# EAGLE design TSS_Rev3_Shield (EAGLE 7.3.0)
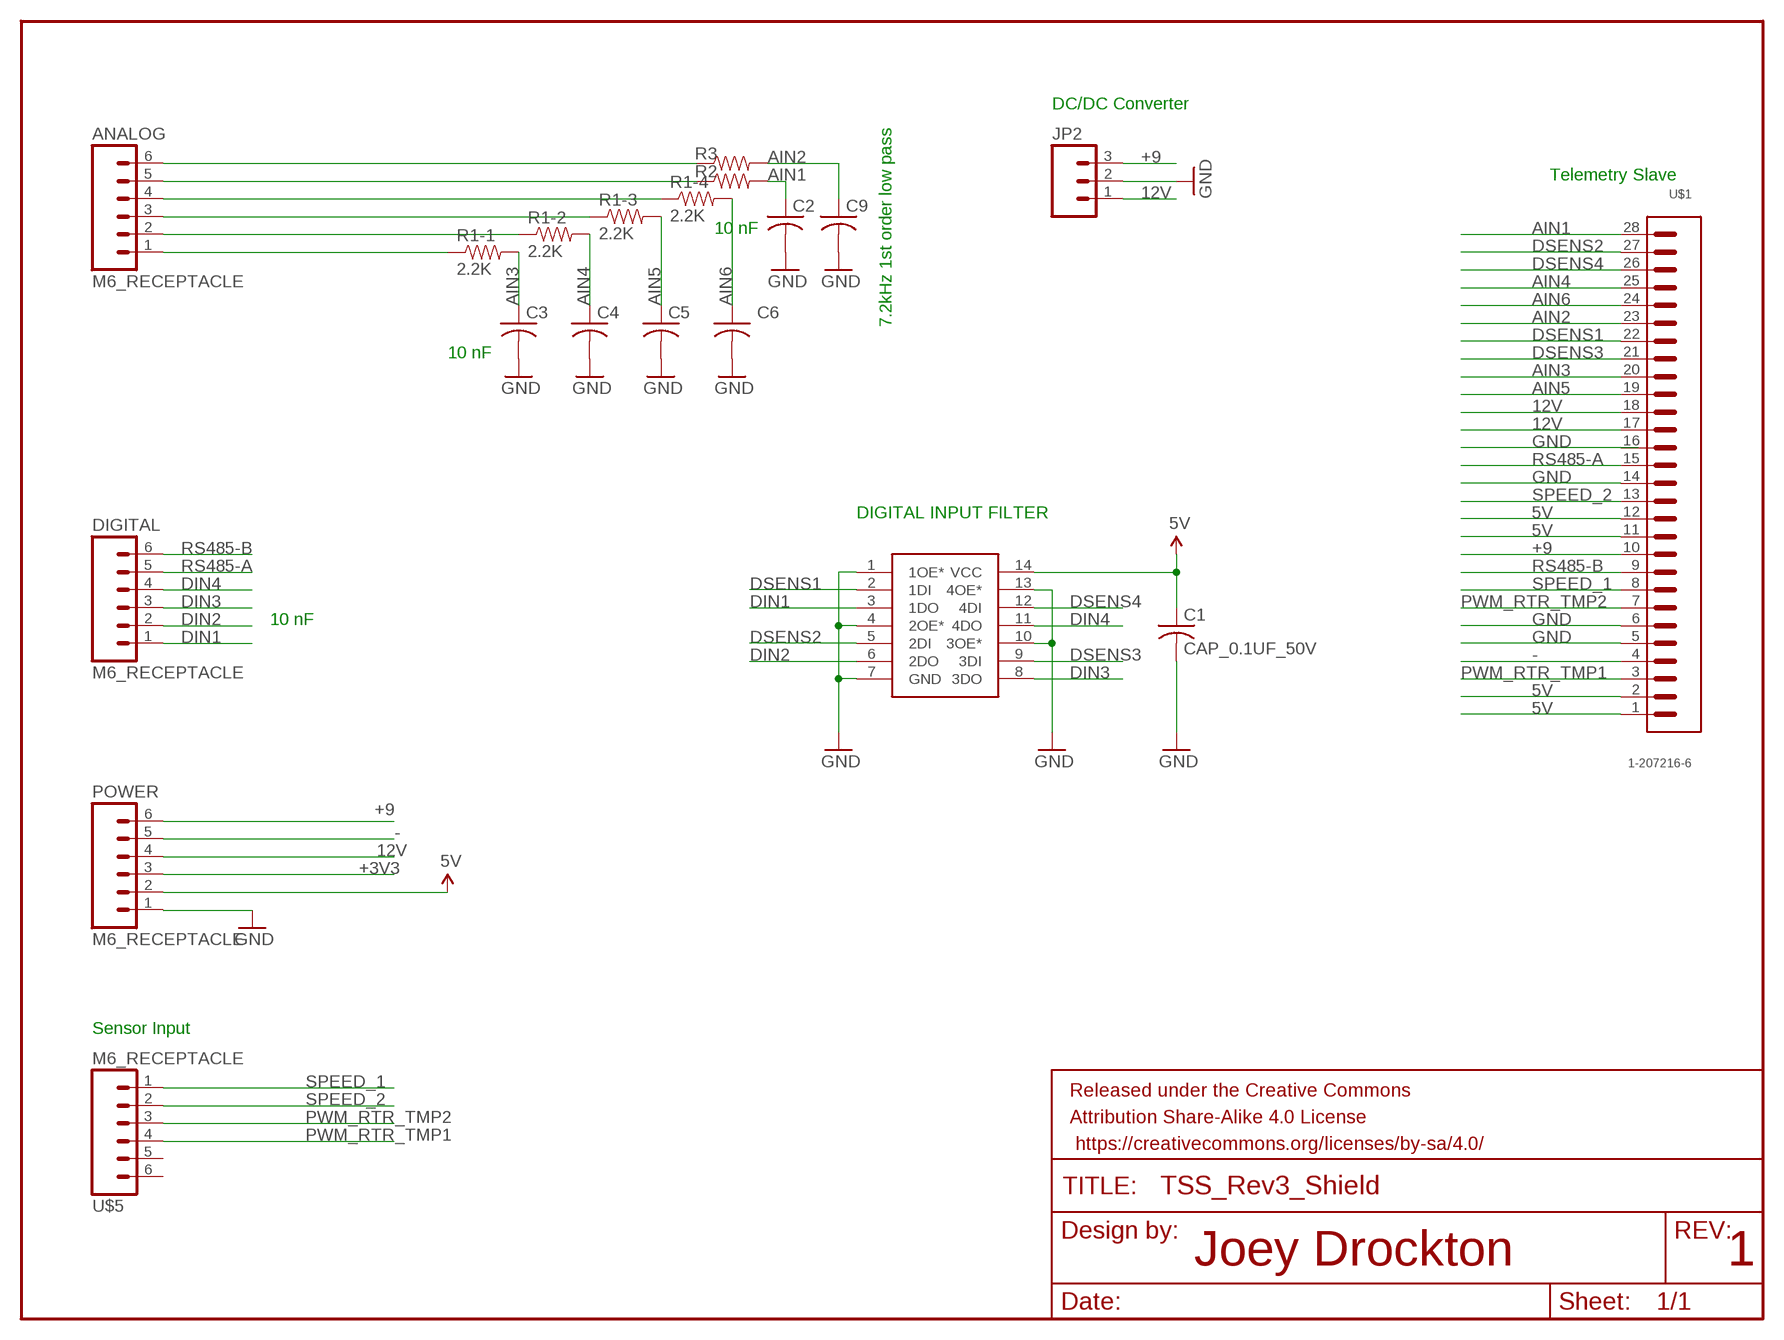
[diagram p0: schematic, sheet 1]

## Parts
ANALOG  M6_RECEPTACLE  [6X.1]
C1  CAP_0.1UF_50V  [0603]
C2  CAP_10NF_50V  [0603]
C3  CAP_10NF_50V  [0603]
C4  CAP_10NF_50V  [0603]
C5  CAP_10NF_50V  [0603]
C6  CAP_10NF_50V  [0603]
C9  CAP_10NF_50V  [0603]
DIGITAL  M6_RECEPTACLE  [6X.1]
FRAME1  FRAME-LETTERNO_PACKAGE  [DUMMY]
JP2  M03PTH  [1X03]
POWER  M6_RECEPTACLE  [6X.1]
R1  2.2K  RN-4_2.2K  [MNR14]
R2  RES_2.2K_1%  [0603]
R3  RES_2.2K_1%  [0603]
U$1  1-207216-6  [1-207216-6]
U$2  74HC125S14-13  [SO-14]
U$5  M6_RECEPTACLE  [6X.1]

## Nets
5V: C1.1(+) POWER.2 U$1.1 U$1.2 U$1.11 U$1.12 U$2.14(VCC)
12V: JP2.1 POWER.4 U$1.17 U$1.18
+3V3: POWER.3
+9: JP2.3 POWER.6 U$1.10
-: POWER.5 U$1.4
AIN1: C2.1(+) R2.2 U$1.28
AIN2: C9.1(+) R3.2 U$1.23
AIN3: C3.1(+) R1.8 U$1.20
AIN4: C4.1(+) R1.7 U$1.25
AIN5: C5.1(+) R1.6 U$1.19
AIN6: C6.1(+) R1.5 U$1.24
DIN1: DIGITAL.1 U$2.3(1DO)
DIN2: DIGITAL.2 U$2.6(2DO)
DIN3: DIGITAL.3 U$2.8(3DO)
DIN4: DIGITAL.4 U$2.11(4DO)
DSENS1: U$1.22 U$2.2(1DI)
DSENS2: U$1.27 U$2.5(2DI)
DSENS3: U$1.21 U$2.9(3DI)
DSENS4: U$1.26 U$2.12(4DI)
GND: C1.2(-) C2.2(-) C3.2(-) C4.2(-) C5.2(-) C6.2(-) C9.2(-) JP2.2 POWER.1 U$1.5 U$1.6 U$1.14 U$1.16 U$2.1(1OE*) U$2.4(2OE*) U$2.7(GND) U$2.10(3OE*) U$2.13(4OE*)
N$1: ANALOG.6 R3.1
N$2: ANALOG.5 R2.1
N$5: ANALOG.4 R1.4
N$6: ANALOG.3 R1.3
N$10: ANALOG.2 R1.2
N$11: ANALOG.1 R1.1
PWM_RTR_TMP1: U$1.3 U$5.4
PWM_RTR_TMP2: U$1.7 U$5.3
RS485-A: DIGITAL.5 U$1.15
RS485-B: DIGITAL.6 U$1.9
SPEED_1: U$1.8 U$5.1
SPEED_2: U$1.13 U$5.2
Unconnected: U$5.5 U$5.6

## Notes on the sheet
- DC/DC Converter
- 7.2kHz 1st order low pass
- Telemetry Slave
- 10 nF
- 10 nF
- DIGITAL INPUT FILTER
- 10 nF
- Sensor Input
- Joey Drockton | 1

## Library data of the parts
ANALOG DIGITAL POWER U$5 = FSAE Electric:M6_RECEPTACLE; PARTNO: A32907-ND
C1 = FSAE Electric:CAP; PARTNO: CC0603ZRY5V9BB104
C2-C6 C9 = FSAE Electric:CAP; PARTNO: CL10F103ZB8NNNC
FRAME1 = SparkFun-Aesthetics:FRAME-LETTER: Schematic Frame Standard 8.5x11 US Letter frame; DESIGNER: Nobody; VERSION: v01
JP2 = SparkFun-Connectors:M03: Header 3 Standard 3-pin 0.1" header. Use with straight break away headers (SKU : PRT-00116), right angle break away headers (PRT-00553), swiss pins (PRT-00743), machine pins (PRT-00117), and female headers (PRT-00115). Molex polarized connector foot print use with SKU : PRT-08232 with associated crimp pins and housings.
R1 = FSAE Electric:RN-4; PARTNO: MNR14ERAPJ222
R2 R3 = FSAE Electric:RES: Resistors; PARTNO: RC0603FR-072K2L
U$1 = FSAE Electric:1-207216-6: TE 28 Pin Recepticle to board connector; PARTNO: 1-207216-6
U$2 = FSAE Electric:74HC125S14-13: QUAD IN SHMITT TRIGGER; PARTNO: 74HC125S14-13DICT-ND

## Board
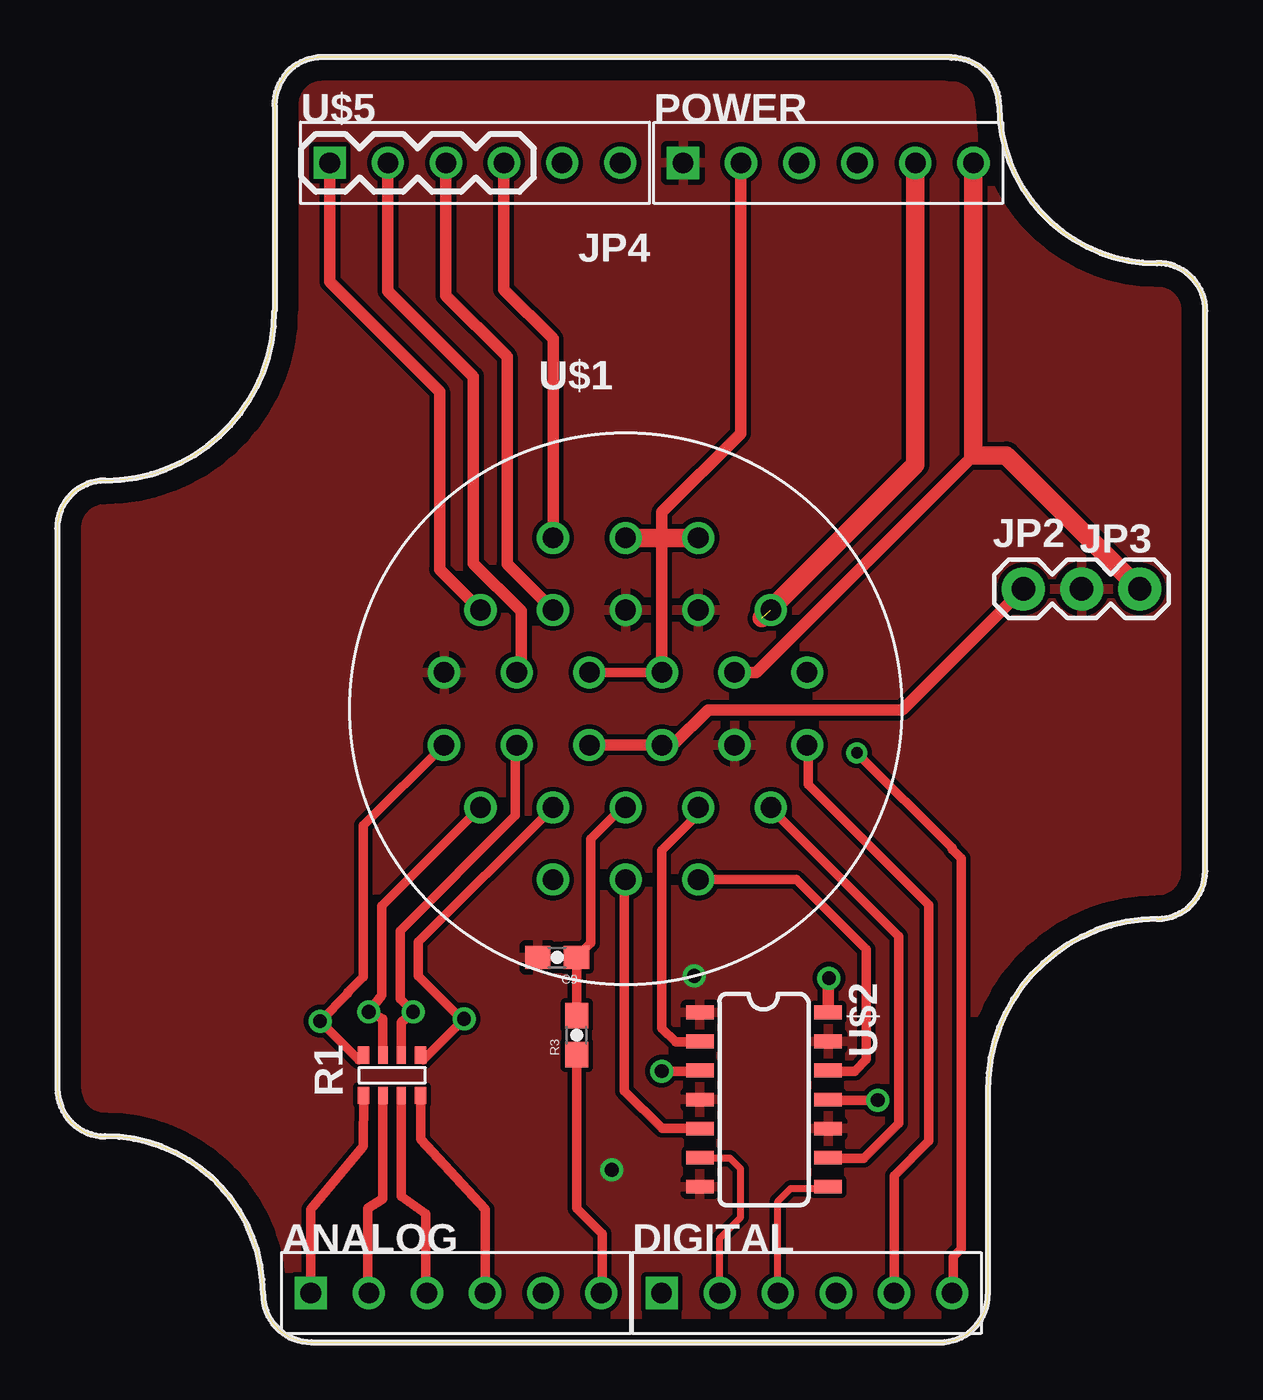
[diagram p1: board, top side]
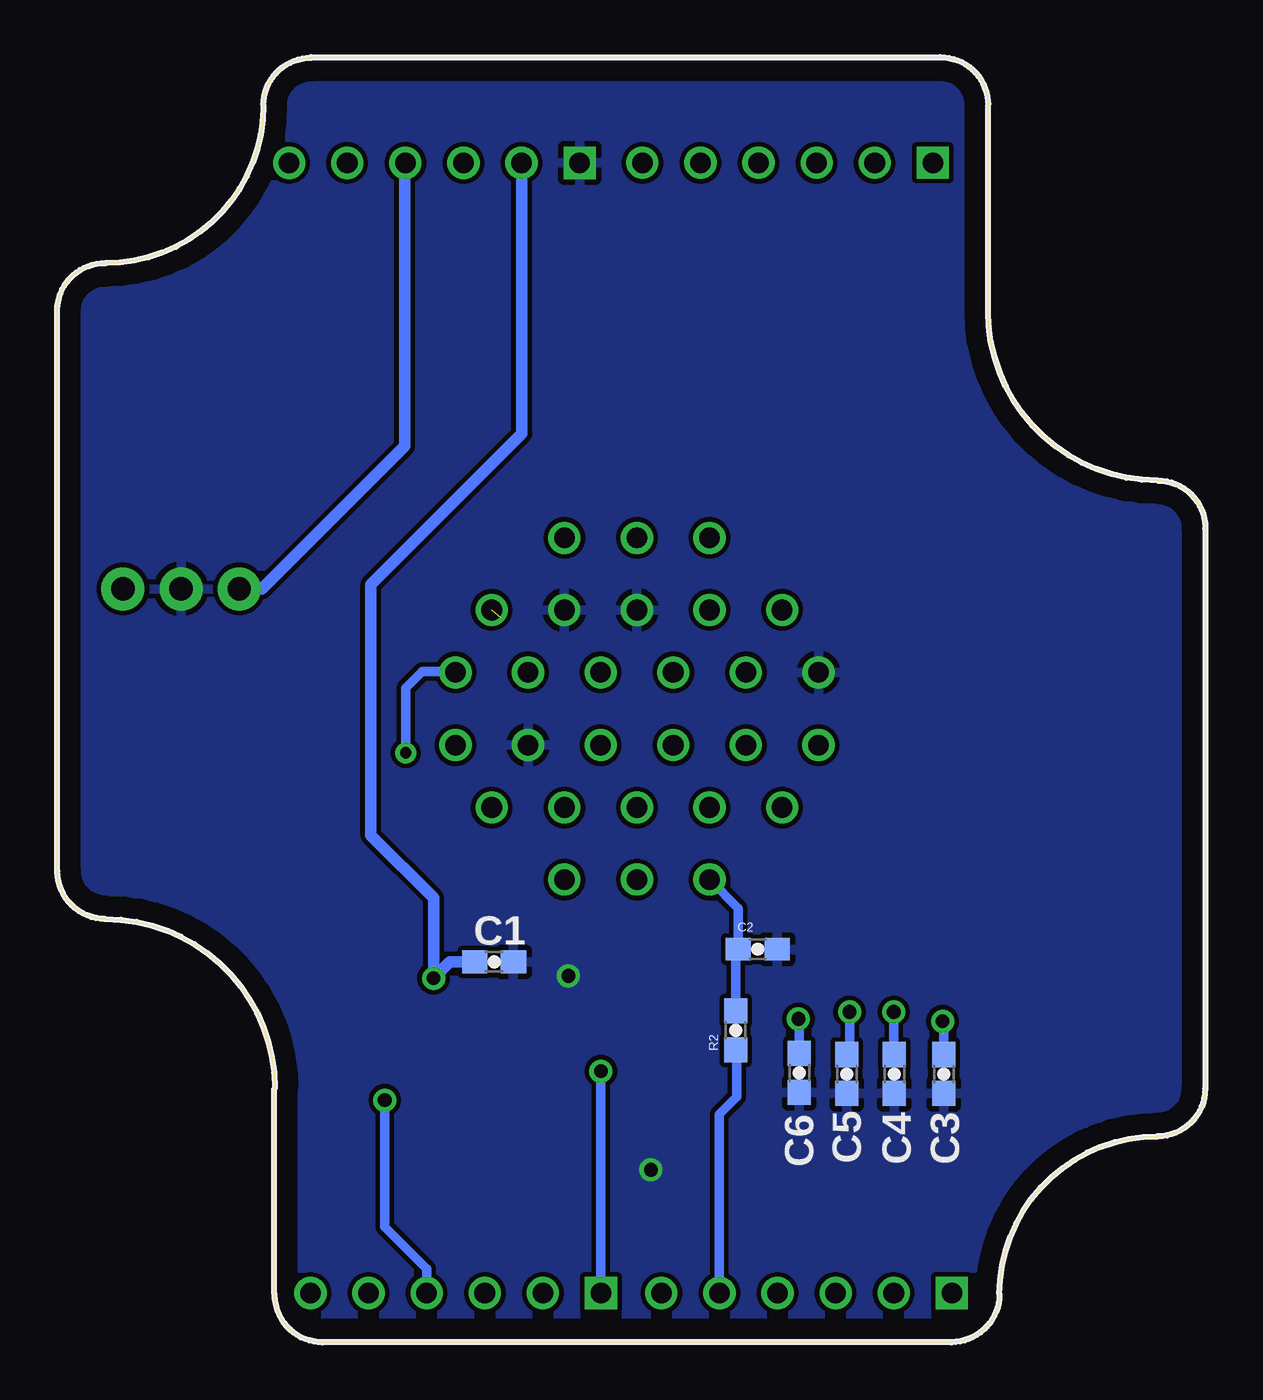
[diagram p2: board, bottom side, seen from below]

Size 50.2 x 56.21 mm. Coordinates in mm from the lower left corner, seen from the top.
Outline: 50.2,20.6 50.2,45.11 arc90 48.09,47.21
Outline: 40.7,2.11 40.7,11.1
Outline: 11.11,0 38.6,0 arc90 40.69,2.11
Outline: 0.01,35.61 0.01,11.1 arc90 2.1,9
Outline: 9.51,54.1 9.51,45.11
Outline: 39.1,56.21 11.59,56.21 arc90 9.5,54.1
Outline: 50.19,20.6 arc-90 48.09,18.52 arc90 40.69,11.1
Outline: 11.11,0.01 arc-90 9,2.11 arc90 2.1,9.02
Outline: 0,35.61 arc-90 2.1,37.69 arc90 9.5,45.11
Outline: 39.1,56.18 arc-90 41.19,54.1 arc90 48.09,47.19
Copper layers (1*16): Top 0.035mm / dielectric 1.5mm / Bottom 0.035mm
Design rules "default": minimum track width 10mil, minimum drill 24mil, track to track 8mil, track to pad 8mil, pad to pad 8mil, via to via 8mil, smd to smd 8mil, copper to edge 40mil, drill to drill 8mil, minimum pad ring 10mil, minimum via ring 8mil, stop-mask expansion 4mil, vias tented up to drill 0mil, thermal gap 10mil

### Footprints (pad centres in the part's own frame; a part is rotated, then mirrored left to right if it is on the bottom)
6X.1 = drill 0.9 square: 1 0,0 | drill 0.9: 2 2.54,0; 3 5.08,0; 4 7.62,0; 5 10.16,0; 6 12.7,0
0603 = smd 1.1 x 1: 1 -0.85,0; 2 0.85,0
1X03 = drill 1.016 pad 1.88: 1 0,0; 2 2.54,0; 3 5.08,0
MNR14 = smd 0.5 x 0.75: 1 -1.25,-0.9; 4 1.25,-0.9; 5 1.25,0.85; 8 -1.25,0.85 | smd 0.4 x 0.75: 2 -0.4,-0.9; 3 0.4,-0.9; 6 0.4,0.85; 7 -0.4,0.85
1-207216-6 = drill 0.9: 1 3.175,7.468; 2 0,7.468; 3 -3.175,7.468; 4 6.35,4.318; 5 3.175,4.318; 6 0,4.318; 7 -3.175,4.318; 8 -6.35,4.318; 9 7.938,1.587; 10 4.763,1.587; 11 1.587,1.587; 12 -1.587,1.587; 13 -4.763,1.587; 14 -7.938,1.587; 15 7.938,-1.587; 16 4.763,-1.587; 17 1.587,-1.587; 18 -1.587,-1.587; 19 -4.763,-1.587; 20 -7.938,-1.587; 21 6.35,-4.318; 22 3.175,-4.318; 23 0,-4.318; 24 -3.175,-4.318; 25 -6.35,-4.318; 26 3.175,-7.468; 27 0,-7.468; 28 -3.175,-7.468
SO-14 = smd 0.6 x 1.2: 1 -3.81,-2.8; 2 -2.54,-2.8; 3 -1.27,-2.8; 4 0,-2.8; 5 1.27,-2.8; 6 2.54,-2.8; 7 3.81,-2.8; 8 3.81,2.8; 9 2.54,2.8; 10 1.27,2.8; 11 0,2.8; 12 -1.27,2.8; 13 -2.54,2.8; 14 -3.81,2.8

### Placement (x,y rotation side)
ANALOG  11.09,2.16 0 top
C1  31.1,16.64 0 bottom
C2  19.57,17.2 0 bottom
C3  11.44,11.73 270 bottom
C4  13.6,11.73 270 bottom
C5  15.68,11.73 270 bottom
C6  17.76,11.78 270 bottom
C9  21.86,16.84 180 top
DIGITAL  26.43,2.16 0 top
FRAME1  6.82,11.46 0 top
JP2  42.25,32.96 0 top
POWER  27.36,51.59 0 top
R1  14.64,11.71 0 top
R2  20.54,13.64 90 bottom
R3  22.72,13.44 90 top
U$1  24.85,27.71 0 top
U$2  30.9,10.62 270 top
U$5  11.92,51.59 0 top

### Tracks (layer width: path | path; a pad name or v marks a point on that pad's centre or on a via)
5V  (via drill 0.6 pad 0.61)
  Top 0.406: U$1.12 U$1.11
  Top 0.508: U$1.11 26.44,35.23 26.44,36.31 29.88,39.75 29.88,51.59 POWER.2 | U$2.14 33.7,15.89 v33.74,15.93
  Top 0.813: U$1.2 U$1.1 26.49,35.18 26.44,35.23
  Bottom 0.508: POWER.2 29.88,51.59 29.88,39.75 36.49,33.15 36.49,22.17 33.74,19.43 v33.74,15.93 33.03,16.64 C1.1
12V
  Top 0.508: U$1.18 U$1.17 26.92,26.12 28.46,27.66 36.95,27.66 JP2.1
  Bottom 0.508: JP2.1 41.25,32.96 35.01,39.19 35.01,51.58 POWER.4
+9
  Top 0.508: U$1.10 30.57,29.3 40.06,38.79
  Top 0.813: POWER.6 40.06,38.79 41.5,38.79 JP2.3
-  (1 unrouted)
  Top 0.813: POWER.5 37.52,38.4 30.8,31.67
AIN1
  Bottom 0.406: R2.2 20.54,17.08 C2.1 20.42,18.99 U$1.28
AIN2
  Top 0.406: U$1.23 24.7,23.39 23.33,22.02 23.33,17.46 C9.1 22.71,14.3 R3.2
AIN3  (via drill 0.6 pad 0.3)
  Top 0.406: U$1.20 13.39,22.6 13.39,15.98 12.71,15.3 12.71,15.27 v11.49,14.05 13.18,12.36 R1.8
  Bottom 0.406: C3.1 11.44,13.99 v11.49,14.05
AIN4  (via drill 0.6)
  Top 0.406: U$1.25 14.19,19.08 14.19,15.17 v13.63,14.45 14.24,14.14 R1.7
  Bottom 0.406: v13.63,14.45 13.63,12.66 C4.1
AIN5  (via drill 0.6)
  Top 0.406: U$1.19 20.03,26.06 20.03,23.04 14.99,18 14.99,15.02 v15.56,14.45 15.05,13.99 R1.6
  Bottom 0.406: v15.56,14.45 15.56,12.66 C5.1
AIN6  (via drill 0.6 pad 0.3)
  Top 0.406: U$1.24 15.79,17.51 15.79,16.03 17.67,14.15 v17.79,14.15 16,12.36 R1.5
  Bottom 0.406: C6.1 17.76,14.12 v17.79,14.15
DIN1  (via drill 0.6 pad 0.3)
  Top 0.406: v26.43,11.86 28.07,11.86 U$2.3
  Bottom 0.406: DIGITAL.1 v26.43,11.86
DIN2
  Top 0.305: DIGITAL.2 28.97,4.55 29.88,5.46 29.88,7.59 29.43,8.05 28.13,8.05 U$2.6
DIN3
  Top 0.305: DIGITAL.3 31.51,6.17 32.07,6.73 33.79,6.73 33.9,6.83 33.73,6.83 U$2.8
DIN4  (via drill 0.6 pad 0.3)
  Top 0.406: v35.88,10.59 33.73,10.59 U$2.11
  Bottom 0.406: DIGITAL.4 34.05,3.23 35.88,5.05 v35.88,10.59
DSENS1
  Top 0.406: U$1.22 28.03,23.11 26.43,21.51 26.43,13.74 27.04,13.13 28.07,13.13 U$2.2
DSENS2
  Top 0.406: U$2.5 26.45,9.35 24.8,11 24.8,20.19 U$1.27
DSENS3
  Top 0.406: U$1.21 31.2,23.34 36.79,17.75 36.79,9.58 35.27,8.05 33.73,8.05 U$2.9
DSENS4
  Top 0.406: U$1.26 32.32,20.24 35.37,17.2 35.37,12.37 34.86,11.86 33.73,11.86 U$2.12
GND  (via drill 0.6)
  other vias: 27.85,16.03 24.24,7.54
  pour Bottom: -0.5,0.79 -0.5,56.16 49.8,56.16 49.7,-0.03
  pour Top: 10.17,0.03 8.39,1.8 8.39,5.11 8.14,5.36 5.35,8.15 2.04,8.15 0.01,10.19 0.01,36.86 0.77,37.62 4.08,37.62 8.65,42.19 8.65,44.22 9.41,44.98 9.41,54.64 10.68,55.91 40.4,55.91 40.4,55.4 41.67,54.13 41.67,52.1 41.67,51.08 43.95,48.79 44.21,48.79 45.48,47.52 48.27,47.52 50.56,45.24 50.56,20.6 48.53,18.57 45.99,18.57 44.72,17.3 44.46,17.3 42.18,15.01 41.92,15.01 40.91,14 40.91,0.28 40.65,0.03
N$1
  Top 0.406: R3.1 22.72,5.87 23.84,4.75 23.84,2.21 ANALOG.6
N$2
  Bottom 0.406: ANALOG.5 21.25,9.98 20.48,10.74 20.48,12.74 R2.1
N$5
  Top 0.406: ANALOG.4 18.71,5.82 15.9,8.88 R1.4
N$6
  Top 0.406: ANALOG.3 16.12,2.21 16.12,5.61 15.05,6.38 R1.3
N$10
  Top 0.406: ANALOG.2 13.58,2.21 13.58,5.87 14.24,6.28 R1.2
N$11
  Top 0.406: ANALOG.1 11.09,5.82 13.38,8.57 R1.1
PWM_RTR_TMP1
  Top 0.508: U$1.3 21.68,43.89 19.52,46.05 19.52,51.57 U$5.4
PWM_RTR_TMP2
  Top 0.508: U$5.3 17,45.78 19.67,43.1 19.67,34.04 U$1.7
RS485-A
  Top 0.406: DIGITAL.5 36.59,7.29 38.11,8.81 38.11,19.13 32.83,24.41 32.83,26.09 U$1.15
RS485-B  (via drill 0.5)
  Top 0.406: v34.96,25.78 39.13,21.62 39.13,21.56 39.53,21.16 39.53,4.09 39.18,3.73 39.18,2.21 DIGITAL.6
  Bottom 0.406: v34.96,25.78 34.96,28.63 34.25,29.34 32.83,29.34 U$1.9
SPEED_1
  Top 0.508: U$5.1 11.92,46.39 16.73,41.58 16.73,33.81 U$1.8
SPEED_2
  Top 0.508: U$5.2 14.46,45.98 18.2,42.24 18.2,34.06 20.28,31.98 20.28,29.49 U$1.13

### Text on the board
_tsilk: JP4 | JP3